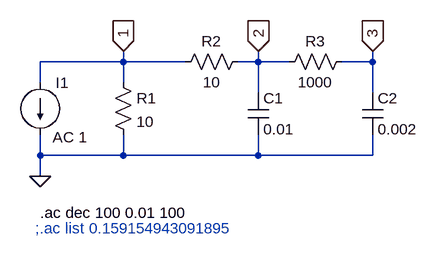
[diagram p0: schematic test_15.asc]
test_15.asc, the LTspice schematic file:
Version 4
SHEET 1 880 680
WIRE 16 80 16 64
WIRE 16 80 -112 80
WIRE 112 80 16 80
WIRE 224 80 224 64
WIRE 224 80 192 80
WIRE 272 80 224 80
WIRE 400 80 400 64
WIRE 400 80 352 80
WIRE -112 112 -112 80
WIRE 16 112 16 80
WIRE 224 128 224 80
WIRE 400 128 400 80
WIRE -112 224 -112 192
WIRE 16 224 16 192
WIRE 16 224 -112 224
WIRE 224 224 224 192
WIRE 224 224 16 224
WIRE 400 224 400 192
WIRE 400 224 224 224
WIRE -112 256 -112 224
FLAG -112 256 0
FLAG 16 64 1
IOPIN 16 64 In
FLAG 224 64 2
IOPIN 224 64 In
FLAG 400 64 3
IOPIN 400 64 In
SYMBOL current -112 112 R0
WINDOW 123 19 84 Left 2
WINDOW 39 0 0 Left 0
SYMATTR InstName I1
SYMATTR Value ""
SYMATTR Value2 AC 1
SYMBOL res 0 96 R0
SYMATTR InstName R1
SYMATTR Value 10
SYMBOL res 208 64 R90
WINDOW 0 0 56 VBottom 2
WINDOW 3 32 56 VTop 2
SYMATTR InstName R2
SYMATTR Value 10
SYMBOL res 368 64 R90
WINDOW 0 0 56 VBottom 2
WINDOW 3 32 56 VTop 2
SYMATTR InstName R3
SYMATTR Value 1000
SYMBOL cap 208 128 R0
SYMATTR InstName C1
SYMATTR Value 0.01
SYMBOL cap 384 128 R0
SYMATTR InstName C2
SYMATTR Value 0.002
TEXT -112 312 Left 2 !.ac dec 100 0.01 100
TEXT -120 336 Left 2 ;;.ac list 0.159154943091895

The netlist it stands for:
* test_15.asc
I1 1 0 AC 1
R1 1 0 10
R2 2 1 10
R3 3 2 1000
C1 2 0 0.01
C2 3 0 0.002
.ac dec 100 0.01 100
* ;.ac list 0.159154943091895
.backanno
.end